# EasyEDA schematic SCH_Macropad_2024-08-07.json
TITLE: Macropad; REV: 1.0; Date: 2024-01-09; Sheet: 1/1; Drawn By: shuchirj; Company: N/A
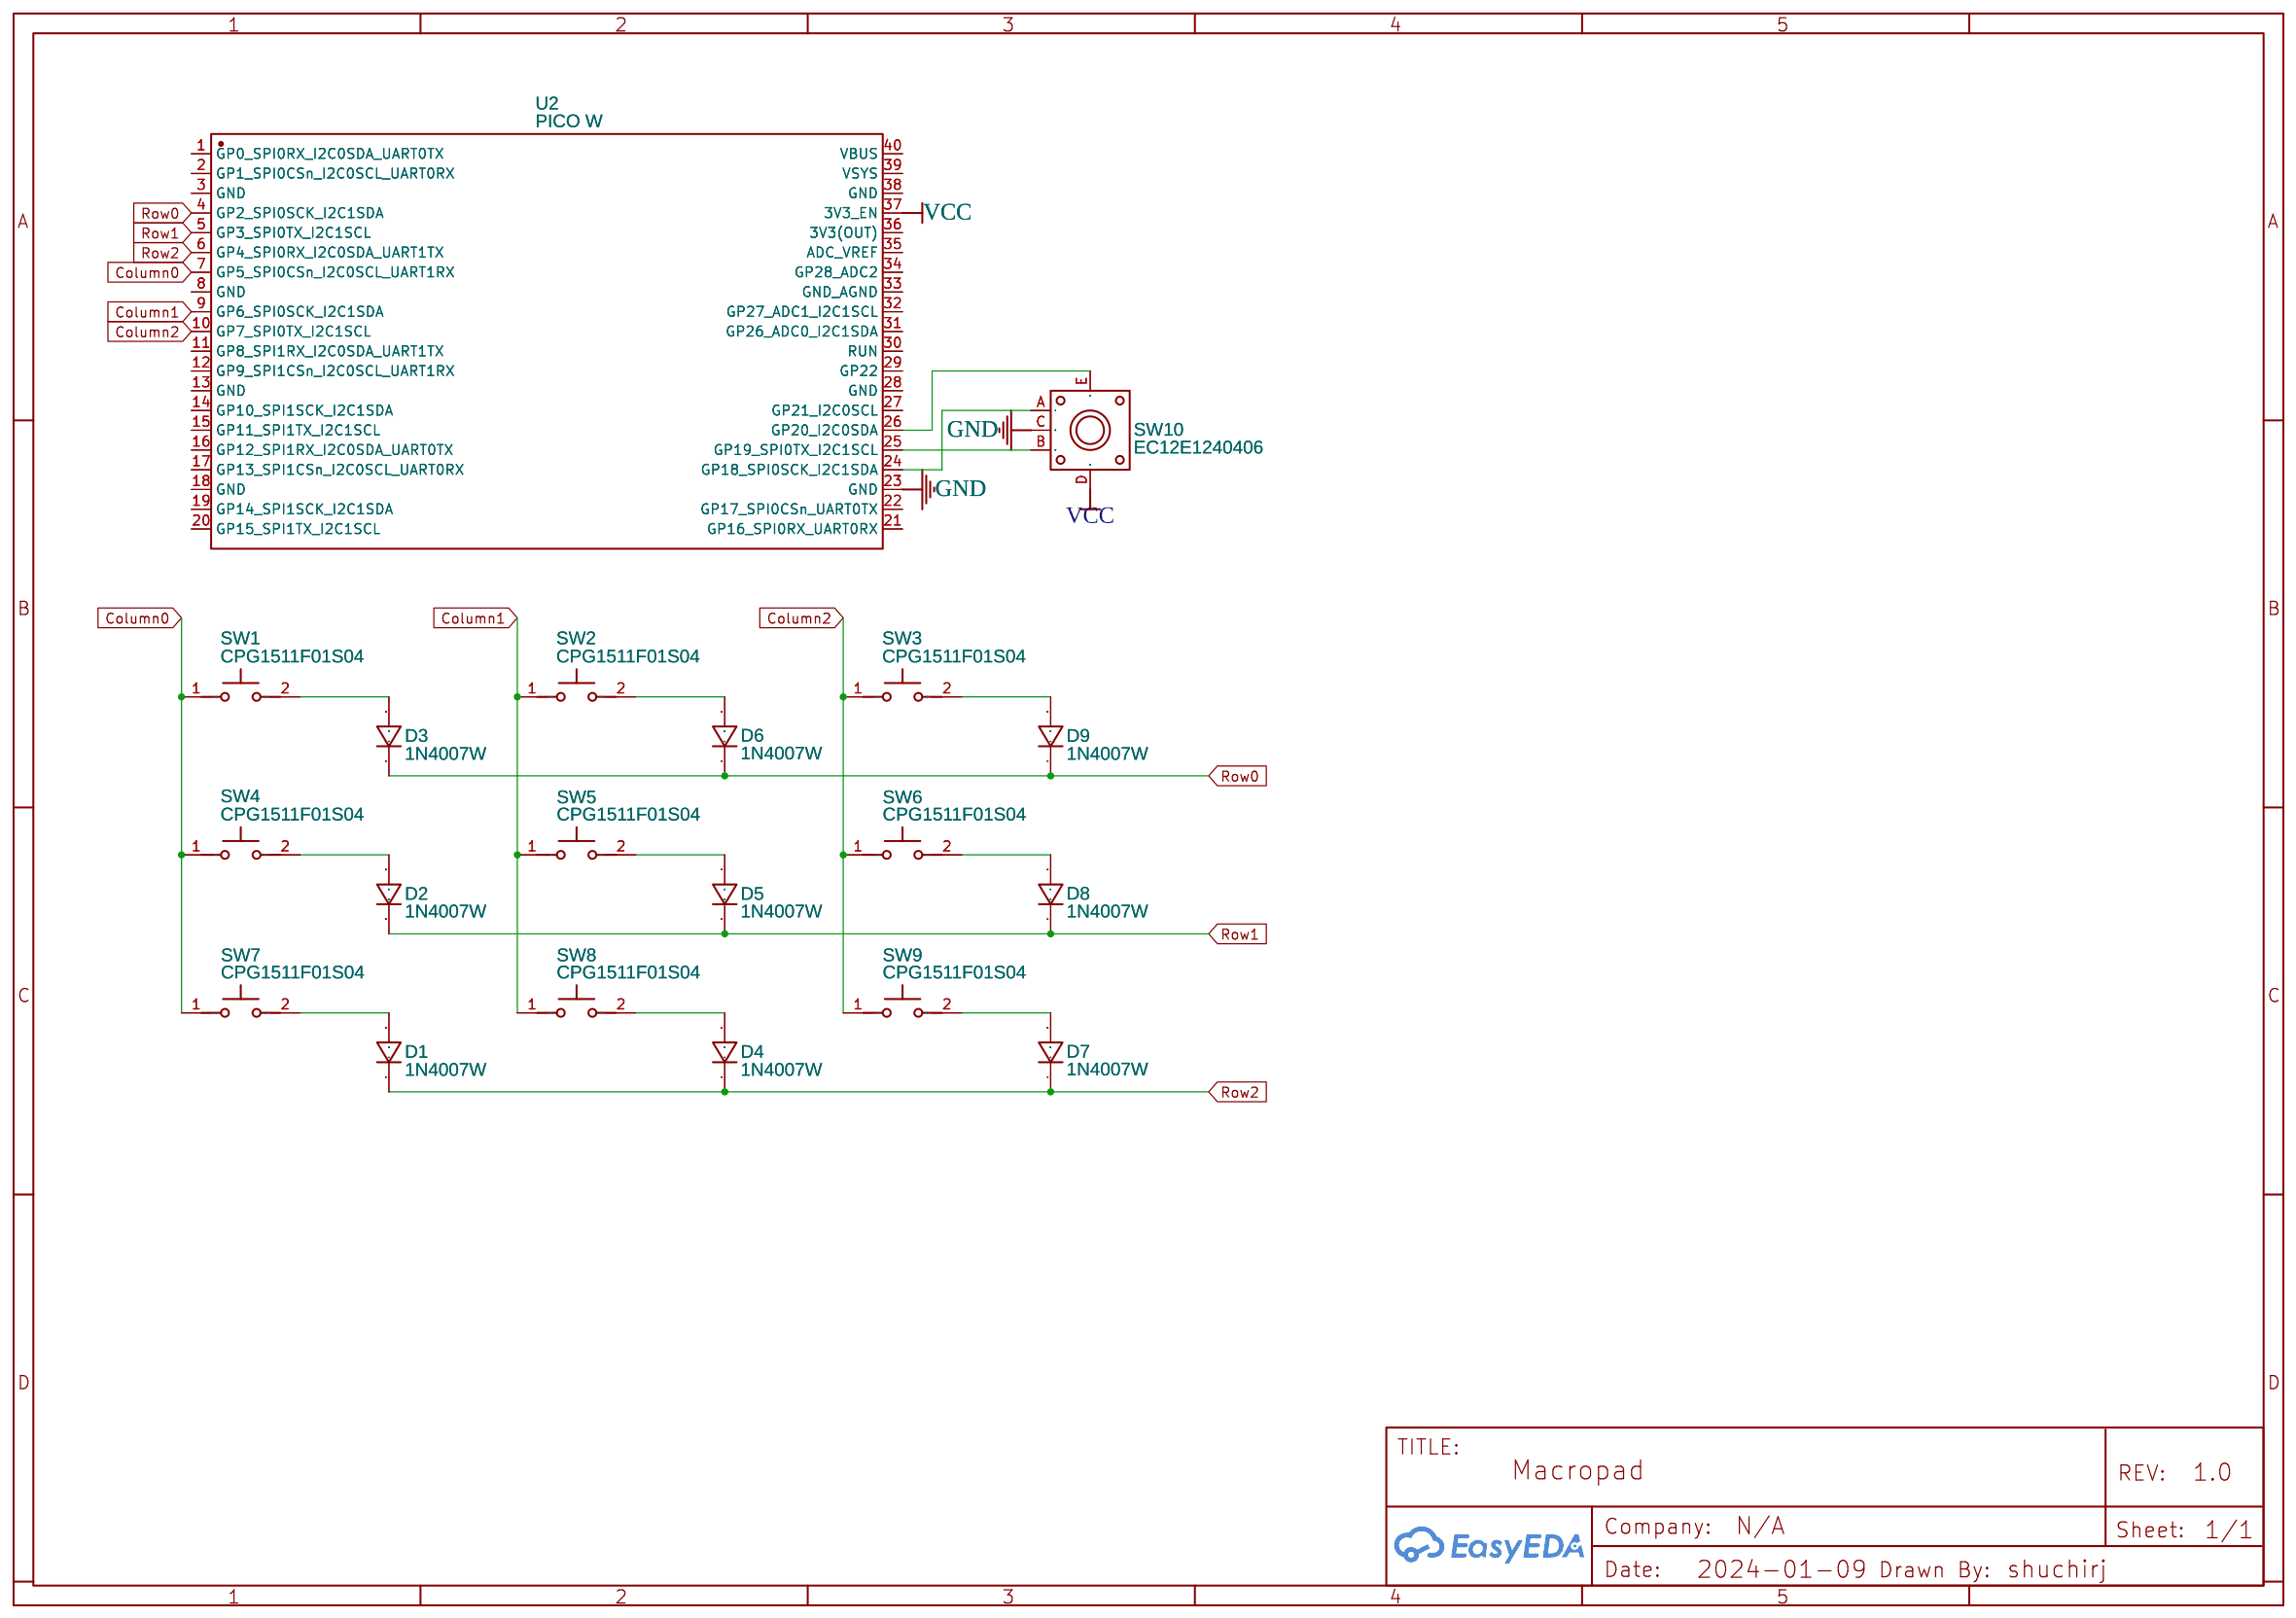
[diagram p0: schematic sheet]

## Parts
D1  1N4007W  [SOD-123_L2.8-W1.8-LS3.7-RD]
D2  1N4007W  [SOD-123_L2.8-W1.8-LS3.7-RD]
D3  1N4007W  [SOD-123_L2.8-W1.8-LS3.7-RD]
D4  1N4007W  [SOD-123_L2.8-W1.8-LS3.7-RD]
D5  1N4007W  [SOD-123_L2.8-W1.8-LS3.7-RD]
D6  1N4007W  [SOD-123_L2.8-W1.8-LS3.7-RD]
D7  1N4007W  [SOD-123_L2.8-W1.8-LS3.7-RD]
D8  1N4007W  [SOD-123_L2.8-W1.8-LS3.7-RD]
D9  1N4007W  [SOD-123_L2.8-W1.8-LS3.7-RD]
SW1  CPG1511F01S04  [KEY-TH_CPG1511F01S0X]
SW2  CPG1511F01S04  [KEY-TH_CPG1511F01S0X]
SW3  CPG1511F01S04  [KEY-TH_CPG1511F01S0X]
SW4  CPG1511F01S04  [KEY-TH_CPG1511F01S0X]
SW5  CPG1511F01S04  [KEY-TH_CPG1511F01S0X]
SW6  CPG1511F01S04  [KEY-TH_CPG1511F01S0X]
SW7  CPG1511F01S04  [KEY-TH_CPG1511F01S0X]
SW8  CPG1511F01S04  [KEY-TH_CPG1511F01S0X]
SW9  CPG1511F01S04  [KEY-TH_CPG1511F01S0X]
SW10  EC12E1240406  [SW-SMD_EC12E1240406]
U2  PICO W  [LCC-40_L51.0-W21.0-P2.54-BL_RP2040-BASED]

## Library data of the parts
D1-D9 = 1N4007W: Supplier: LCSC; Supplier Part: C328592; Manufacturer: BLUE ROCKET; Contributor: LCEDA_Lib
SW1-SW9 = CPG1511F01S04: Contributor: LCSC; Supplier: LCSC; Supplier Part: C400226; Manufacturer: Kailh; JLCPCB Part Class: Extended Part
SW10 = EC12E1240406: Contributor: LCSC; Supplier: LCSC; Supplier Part: C351234; Manufacturer: ALPS Electric; JLCPCB Part Class: Extended Part
U2 = PICO W: Supplier: LCSC; Supplier Part: C7203003; Manufacturer: Raspberry Pi(树莓派); Contributor: lcsc; JLCPCB Part Class: Extended Part

## Nets
GND: SW10.C U2.23(GND)
VCC: SW10.D U2.37(3V3_EN)
Column0: SW1.1 SW4.1 SW7.1 U2.7(GP5_SPI0CSn_I2C0SCL_UART1RX)
Column1: SW2.1 SW5.1 SW8.1 U2.9(GP6_SPI0SCK_I2C1SDA)
Column2: SW3.1 SW6.1 SW9.1 U2.10(GP7_SPI0TX_I2C1SCL)
Row0: D3.1 D6.1 D9.1 U2.4(GP2_SPI0SCK_I2C1SDA)
Row1: D2.1 D5.1 D8.1 U2.5(GP3_SPI0TX_I2C1SCL)
Row2: D1.1 D4.1 D7.1 U2.6(GP4_SPI0RX_I2C0SDA_UART1TX)
Net-(D1-2): D1.2 SW7.2
Net-(D2-2): D2.2 SW4.2
Net-(D3-2): D3.2 SW1.2
Net-(D4-2): D4.2 SW8.2
Net-(D5-2): D5.2 SW5.2
Net-(D6-2): D6.2 SW2.2
Net-(D7-2): D7.2 SW9.2
Net-(D8-2): D8.2 SW6.2
Net-(D9-2): D9.2 SW3.2
Net-(SW10-A): SW10.A U2.24(GP18_SPI0SCK_I2C1SDA)
Net-(SW10-B): SW10.B U2.25(GP19_SPI0TX_I2C1SCL)
Net-(SW10-E): SW10.E U2.26(GP20_I2C0SDA)

Not connected (* = marked no-connect by the designer): U2 1(GP0_SPI0RX_I2C0SDA_UART0TX) 2(GP1_SPI0CSn_I2C0SCL_UART0RX) 3(GND) 8(GND) 11(GP8_SPI1RX_I2C0SDA_UART1TX) 12(GP9_SPI1CSn_I2C0SCL_UART1RX) 13(GND) 14(GP10_SPI1SCK_I2C1SDA) 15(GP11_SPI1TX_I2C1SCL) 16(GP12_SPI1RX_I2C0SDA_UART0TX) 17(GP13_SPI1CSn_I2C0SCL_UART0RX) 18(GND) 19(GP14_SPI1SCK_I2C1SDA) 20(GP15_SPI1TX_I2C1SCL) 21(GP16_SPI0RX_UART0RX) 22(GP17_SPI0CSn_UART0TX) 27(GP21_I2C0SCL) 28(GND) 29(GP22) 30(RUN) 31(GP26_ADC0_I2C1SDA) 32(GP27_ADC1_I2C1SCL) 33(GND_AGND) 34(GP28_ADC2) 35(ADC_VREF) 36(3V3(OUT)) 38(GND) 39(VSYS) 40(VBUS)
